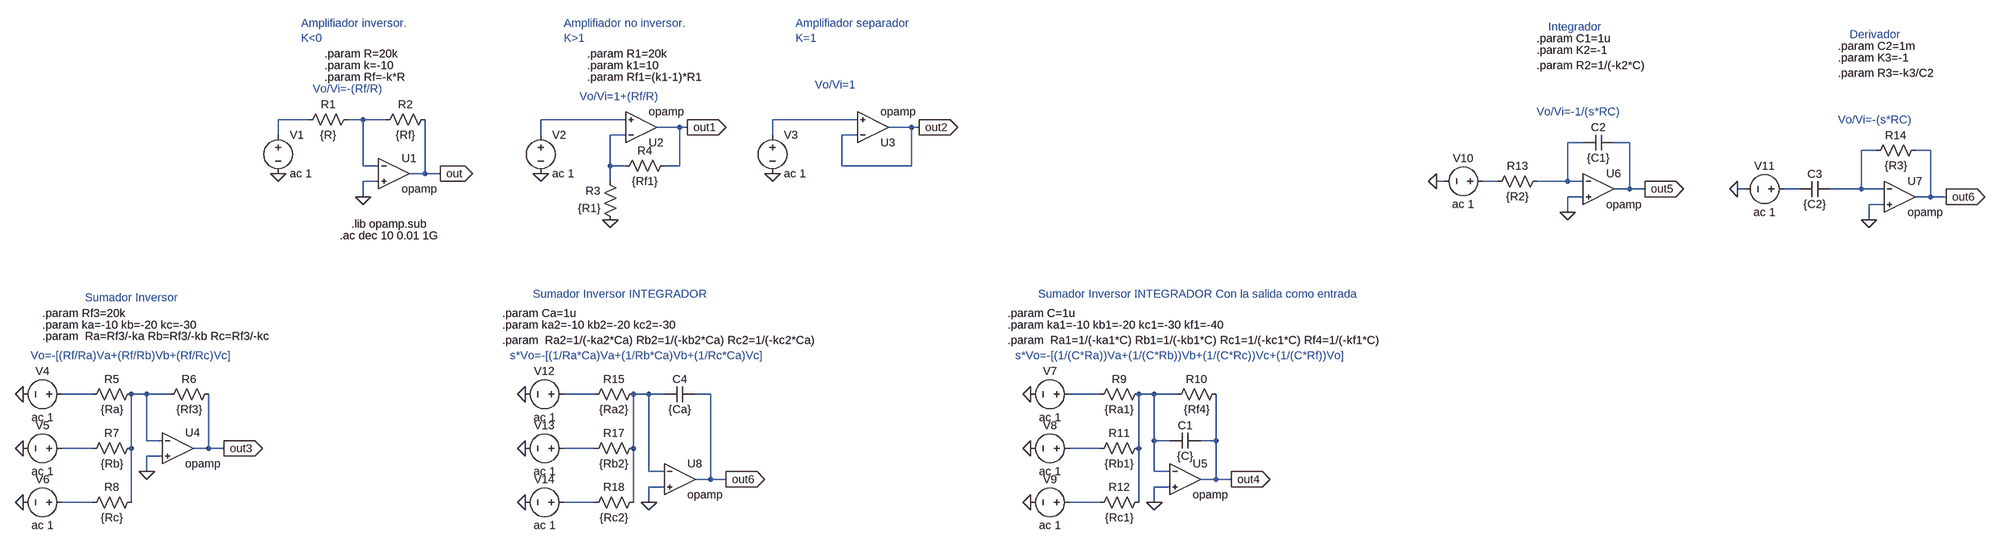
[diagram p0: schematic basicos.asc]
basicos.asc, the LTspice schematic file:
Version 4
SHEET 1 4512 1040
WIRE -96 128 -160 128
WIRE 16 128 -16 128
WIRE 64 128 16 128
WIRE 560 128 384 128
WIRE 1040 128 864 128
WIRE 672 144 624 144
WIRE 688 144 672 144
WIRE 1152 144 1104 144
WIRE 1168 144 1152 144
WIRE -160 160 -160 128
WIRE 384 160 384 128
WIRE 560 160 528 160
WIRE 864 160 864 128
WIRE 1040 160 1008 160
WIRE 3648 176 3616 176
WIRE 3744 176 3712 176
WIRE 4256 192 4224 192
WIRE 4368 192 4336 192
WIRE 16 224 16 128
WIRE 48 224 16 224
WIRE 528 224 528 160
WIRE 560 224 528 224
WIRE 672 224 672 144
WIRE 672 224 640 224
WIRE 1008 224 1008 160
WIRE 1152 224 1152 144
WIRE 1152 224 1008 224
WIRE 144 240 144 128
WIRE 144 240 112 240
WIRE 176 240 144 240
WIRE 48 256 16 256
WIRE 528 256 528 224
WIRE 3360 256 3344 256
WIRE 3472 256 3440 256
WIRE 3616 256 3616 176
WIRE 3616 256 3552 256
WIRE 3648 256 3616 256
WIRE 3744 272 3744 176
WIRE 3744 272 3712 272
WIRE 3776 272 3744 272
WIRE 3984 272 3968 272
WIRE 4096 272 4064 272
WIRE 4224 272 4224 192
WIRE 4224 272 4160 272
WIRE 4272 272 4224 272
WIRE 16 288 16 256
WIRE 3648 288 3616 288
WIRE 4368 288 4368 192
WIRE 4368 288 4336 288
WIRE 4400 288 4368 288
WIRE 4272 304 4240 304
WIRE 3616 320 3616 288
WIRE 4240 336 4240 304
WIRE -544 752 -608 752
WIRE -432 752 -464 752
WIRE -384 752 -432 752
WIRE 496 752 432 752
WIRE 608 752 576 752
WIRE 640 752 608 752
WIRE 736 752 704 752
WIRE 1616 752 1552 752
WIRE 1728 752 1696 752
WIRE 1776 752 1728 752
WIRE -432 848 -432 752
WIRE -400 848 -432 848
WIRE 1728 848 1728 752
WIRE 1760 848 1728 848
WIRE 1856 848 1856 752
WIRE 1856 848 1824 848
WIRE -544 864 -608 864
WIRE -464 864 -464 752
WIRE -304 864 -304 752
WIRE -304 864 -336 864
WIRE -272 864 -304 864
WIRE 496 864 432 864
WIRE 576 864 576 752
WIRE 1616 864 1552 864
WIRE 1696 864 1696 752
WIRE -400 880 -432 880
WIRE -432 912 -432 880
WIRE 608 912 608 752
WIRE 640 912 608 912
WIRE 1728 912 1728 848
WIRE 1760 912 1728 912
WIRE 736 928 736 752
WIRE 736 928 704 928
WIRE 768 928 736 928
WIRE 1856 928 1856 848
WIRE 1856 928 1824 928
WIRE 1888 928 1856 928
WIRE 640 944 608 944
WIRE 1760 944 1728 944
WIRE -544 976 -608 976
WIRE -464 976 -464 864
WIRE 496 976 432 976
WIRE 576 976 576 864
WIRE 608 976 608 944
WIRE 1616 976 1552 976
WIRE 1696 976 1696 864
WIRE 1728 976 1728 944
FLAG 16 288 0
FLAG -160 240 0
FLAG 176 240 out
IOPIN 176 240 Out
FLAG 384 240 0
FLAG 688 144 out1
IOPIN 688 144 Out
FLAG 528 336 0
FLAG 864 240 0
FLAG 1168 144 out2
IOPIN 1168 144 Out
FLAG -432 912 0
FLAG -688 752 0
FLAG -272 864 out3
IOPIN -272 864 Out
FLAG -688 864 0
FLAG -688 976 0
FLAG 1728 976 0
FLAG 1472 752 0
FLAG 1888 928 out4
IOPIN 1888 928 Out
FLAG 1472 864 0
FLAG 1472 976 0
FLAG 3616 320 0
FLAG 3776 272 out5
IOPIN 3776 272 Out
FLAG 3344 256 0
FLAG 4240 336 0
FLAG 4400 288 out6
IOPIN 4400 288 Out
FLAG 3968 272 0
FLAG 608 976 0
FLAG 352 752 0
FLAG 768 928 out6
IOPIN 768 928 Out
FLAG 352 864 0
FLAG 352 976 0
SYMBOL res 0 112 R90
WINDOW 0 0 56 VBottom 2
WINDOW 3 32 56 VTop 2
SYMATTR InstName R1
SYMATTR Value {R}
SYMBOL res 160 112 R90
WINDOW 0 0 56 VBottom 2
WINDOW 3 32 56 VTop 2
SYMATTR InstName R2
SYMATTR Value {Rf}
SYMBOL OpAmps\\opamp 80 176 R0
SYMATTR InstName U1
SYMBOL voltage -160 144 R0
SYMATTR InstName V1
SYMATTR Value ac 1
SYMBOL res 544 352 R180
WINDOW 0 36 76 Left 2
WINDOW 3 36 40 Left 2
SYMATTR InstName R3
SYMATTR Value {R1}
SYMBOL res 656 208 R90
WINDOW 0 0 56 VBottom 2
WINDOW 3 32 56 VTop 2
SYMATTR InstName R4
SYMATTR Value {Rf1}
SYMBOL OpAmps\\opamp 592 208 M180
SYMATTR InstName U2
SYMBOL voltage 384 144 R0
SYMATTR InstName V2
SYMATTR Value ac 1
SYMBOL OpAmps\\opamp 1072 208 M180
SYMATTR InstName U3
SYMBOL voltage 864 144 R0
SYMATTR InstName V3
SYMATTR Value ac 1
SYMBOL res -448 736 R90
WINDOW 0 0 56 VBottom 2
WINDOW 3 32 56 VTop 2
SYMATTR InstName R5
SYMATTR Value {Ra}
SYMBOL res -288 736 R90
WINDOW 0 0 56 VBottom 2
WINDOW 3 32 56 VTop 2
SYMATTR InstName R6
SYMATTR Value {Rf3}
SYMBOL OpAmps\\opamp -368 800 R0
SYMATTR InstName U4
SYMBOL res -448 848 R90
WINDOW 0 0 56 VBottom 2
WINDOW 3 32 56 VTop 2
SYMATTR InstName R7
SYMATTR Value {Rb}
SYMBOL res -448 960 R90
WINDOW 0 0 56 VBottom 2
WINDOW 3 32 56 VTop 2
SYMATTR InstName R8
SYMATTR Value {Rc}
SYMBOL voltage -592 752 R90
WINDOW 0 -32 56 VBottom 2
WINDOW 3 32 56 VTop 2
WINDOW 123 0 0 Left 0
WINDOW 39 0 0 Left 0
SYMATTR InstName V4
SYMATTR Value ac 1
SYMBOL voltage -592 864 R90
WINDOW 0 -32 56 VBottom 2
WINDOW 3 32 56 VTop 2
WINDOW 123 0 0 Left 0
WINDOW 39 0 0 Left 0
SYMATTR InstName V5
SYMATTR Value ac 1
SYMBOL voltage -592 976 R90
WINDOW 0 -32 56 VBottom 2
WINDOW 3 32 56 VTop 2
WINDOW 123 0 0 Left 0
WINDOW 39 0 0 Left 0
SYMATTR InstName V6
SYMATTR Value ac 1
SYMBOL res 1712 736 R90
WINDOW 0 0 56 VBottom 2
WINDOW 3 32 56 VTop 2
SYMATTR InstName R9
SYMATTR Value {Ra1}
SYMBOL res 1872 736 R90
WINDOW 0 0 56 VBottom 2
WINDOW 3 32 56 VTop 2
SYMATTR InstName R10
SYMATTR Value {Rf4}
SYMBOL OpAmps\\opamp 1792 864 R0
SYMATTR InstName U5
SYMBOL res 1712 848 R90
WINDOW 0 0 56 VBottom 2
WINDOW 3 32 56 VTop 2
SYMATTR InstName R11
SYMATTR Value {Rb1}
SYMBOL res 1712 960 R90
WINDOW 0 0 56 VBottom 2
WINDOW 3 32 56 VTop 2
SYMATTR InstName R12
SYMATTR Value {Rc1}
SYMBOL voltage 1568 752 R90
WINDOW 0 -32 56 VBottom 2
WINDOW 3 32 56 VTop 2
WINDOW 123 0 0 Left 0
WINDOW 39 0 0 Left 0
SYMATTR InstName V7
SYMATTR Value ac 1
SYMBOL voltage 1568 864 R90
WINDOW 0 -32 56 VBottom 2
WINDOW 3 32 56 VTop 2
WINDOW 123 0 0 Left 0
WINDOW 39 0 0 Left 0
SYMATTR InstName V8
SYMATTR Value ac 1
SYMBOL voltage 1568 976 R90
WINDOW 0 -32 56 VBottom 2
WINDOW 3 32 56 VTop 2
WINDOW 123 0 0 Left 0
WINDOW 39 0 0 Left 0
SYMATTR InstName V9
SYMATTR Value ac 1
SYMBOL cap 1824 832 R90
WINDOW 0 0 32 VBottom 2
WINDOW 3 32 32 VTop 2
SYMATTR InstName C1
SYMATTR Value {C}
SYMBOL OpAmps\\opamp 3680 208 R0
SYMATTR InstName U6
SYMBOL cap 3712 160 R90
WINDOW 0 0 32 VBottom 2
WINDOW 3 32 32 VTop 2
SYMATTR InstName C2
SYMATTR Value {C1}
SYMBOL res 3568 240 R90
WINDOW 0 0 56 VBottom 2
WINDOW 3 32 56 VTop 2
SYMATTR InstName R13
SYMATTR Value {R2}
SYMBOL voltage 3456 256 R90
WINDOW 0 -32 56 VBottom 2
WINDOW 3 32 56 VTop 2
WINDOW 123 0 0 Left 0
WINDOW 39 0 0 Left 0
SYMATTR InstName V10
SYMATTR Value ac 1
SYMBOL OpAmps\\opamp 4304 224 R0
SYMATTR InstName U7
SYMATTR SpiceLine2 GBW=100Meg
SYMBOL cap 4160 256 R90
WINDOW 0 0 32 VBottom 2
WINDOW 3 32 32 VTop 2
SYMATTR InstName C3
SYMATTR Value {C2}
SYMBOL res 4352 176 R90
WINDOW 0 0 56 VBottom 2
WINDOW 3 32 56 VTop 2
SYMATTR InstName R14
SYMATTR Value {R3}
SYMBOL voltage 4080 272 R90
WINDOW 0 -32 56 VBottom 2
WINDOW 3 32 56 VTop 2
WINDOW 123 0 0 Left 0
WINDOW 39 0 0 Left 0
SYMATTR InstName V11
SYMATTR Value ac 1
SYMBOL res 592 736 R90
WINDOW 0 0 56 VBottom 2
WINDOW 3 32 56 VTop 2
SYMATTR InstName R15
SYMATTR Value {Ra2}
SYMBOL OpAmps\\opamp 672 864 R0
SYMATTR InstName U8
SYMBOL res 592 848 R90
WINDOW 0 0 56 VBottom 2
WINDOW 3 32 56 VTop 2
SYMATTR InstName R17
SYMATTR Value {Rb2}
SYMBOL res 592 960 R90
WINDOW 0 0 56 VBottom 2
WINDOW 3 32 56 VTop 2
SYMATTR InstName R18
SYMATTR Value {Rc2}
SYMBOL voltage 448 752 R90
WINDOW 0 -32 56 VBottom 2
WINDOW 3 32 56 VTop 2
WINDOW 123 0 0 Left 0
WINDOW 39 0 0 Left 0
SYMATTR InstName V12
SYMATTR Value ac 1
SYMBOL voltage 448 864 R90
WINDOW 0 -32 56 VBottom 2
WINDOW 3 32 56 VTop 2
WINDOW 123 0 0 Left 0
WINDOW 39 0 0 Left 0
SYMATTR InstName V13
SYMATTR Value ac 1
SYMBOL voltage 448 976 R90
WINDOW 0 -32 56 VBottom 2
WINDOW 3 32 56 VTop 2
WINDOW 123 0 0 Left 0
WINDOW 39 0 0 Left 0
SYMATTR InstName V14
SYMATTR Value ac 1
SYMBOL cap 704 736 R90
WINDOW 0 0 32 VBottom 2
WINDOW 3 32 32 VTop 2
SYMATTR InstName C4
SYMATTR Value {Ca}
TEXT -8 344 Left 2 !.lib opamp.sub
TEXT -64 -8 Left 2 !.param R=20k
TEXT -64 16 Left 2 !.param k=-10
TEXT -64 40 Left 2 !.param Rf=-k*R
TEXT -112 -72 Left 2 ;Amplifiador inversor.\nK<0
TEXT -32 368 Left 2 !.ac dec 10 0.01 1G
TEXT 480 -8 Left 2 !.param R1=20k
TEXT 480 16 Left 2 !.param k1=10
TEXT 480 40 Left 2 !.param Rf1=(k1-1)*R1
TEXT 432 -72 Left 2 ;Amplifiador no inversor.\nK>1
TEXT 912 -72 Left 2 ;Amplifiador separador\nK=1
TEXT -648 584 Left 2 !.param Rf3=20k
TEXT -648 608 Left 2 !.param ka=-10 kb=-20 kc=-30
TEXT -648 632 Left 2 !.param  Ra=Rf3/-ka Rb=Rf3/-kb Rc=Rf3/-kc
TEXT -560 552 Left 2 ;Sumador Inversor
TEXT -88 64 Left 2 ;Vo/Vi=-(Rf/R)
TEXT 464 80 Left 2 ;Vo/Vi=1+(Rf/R)
TEXT 952 56 Left 2 ;Vo/Vi=1
TEXT -672 672 Left 2 ;Vo=-[(Rf/Ra)Va+(Rf/Rb)Vb+(Rf/Rc)Vc]
TEXT 1424 584 Left 2 !.param C=1u
TEXT 1424 608 Left 2 !.param ka1=-10 kb1=-20 kc1=-30 kf1=-40
TEXT 1424 640 Left 2 !.param  Ra1=1/(-ka1*C) Rb1=1/(-kb1*C) Rc1=1/(-kc1*C) Rf4=1/(-kf1*C)
TEXT 1488 544 Left 2 ;Sumador Inversor INTEGRADOR Con la salida como entrada
TEXT 1440 672 Left 2 ;s*Vo=-[(1/(C*Ra))Va+(1/(C*Rb))Vb+(1/(C*Rc))Vc+(1/(C*Rf))Vo]
TEXT 3576 -64 Left 2 ;Integrador
TEXT 3552 16 Left 2 !.param R2=1/(-k2*C)
TEXT 3552 112 Left 2 ;Vo/Vi=-1/(s*RC)
TEXT 3552 -40 Left 2 !.param C1=1u
TEXT 3552 -16 Left 2 !.param K2=-1
TEXT 4200 -48 Left 2 ;Derivador
TEXT 4176 32 Left 2 !.param R3=-k3/C2
TEXT 4176 128 Left 2 ;Vo/Vi=-(s*RC)
TEXT 4176 -24 Left 2 !.param C2=1m
TEXT 4176 0 Left 2 !.param K3=-1
TEXT 304 584 Left 2 !.param Ca=1u
TEXT 304 608 Left 2 !.param ka2=-10 kb2=-20 kc2=-30
TEXT 368 544 Left 2 ;Sumador Inversor INTEGRADOR
TEXT 304 640 Left 2 !.param  Ra2=1/(-ka2*Ca) Rb2=1/(-kb2*Ca) Rc2=1/(-kc2*Ca)
TEXT 320 672 Left 2 ;s*Vo=-[(1/Ra*Ca)Va+(1/Rb*Ca)Vb+(1/Rc*Ca)Vc]

The netlist it stands for:
* basicos.asc
R1 N002 N001 {R}
R2 out N002 {Rf}
XU1 N002 0 out opamp Aol=100K GBW=10Meg  ; pins invin noninvin out
V1 N001 0 ac 1
R3 0 N005 {R1}
R4 out1 N005 {Rf1}
XU2 N005 N003 out1 opamp Aol=100K GBW=10Meg  ; pins invin noninvin out
V2 N003 0 ac 1
XU3 out2 N004 out2 opamp Aol=100K GBW=10Meg  ; pins invin noninvin out
V3 N004 0 ac 1
R5 N011 N010 {Ra}
R6 out3 N011 {Rf3}
XU4 N011 0 out3 opamp Aol=100K GBW=10Meg  ; pins invin noninvin out
R7 N011 N016 {Rb}
R8 N011 N019 {Rc}
V4 N010 0 ac 1
V5 N016 0 ac 1
V6 N019 0 ac 1
R9 N015 N014 {Ra1}
R10 out4 N015 {Rf4}
XU5 N015 0 out4 opamp Aol=100K GBW=10Meg  ; pins invin noninvin out
R11 N015 N018 {Rb1}
R12 N015 N021 {Rc1}
V7 N014 0 ac 1
V8 N018 0 ac 1
V9 N021 0 ac 1
C1 out4 N015 {C}
XU6 N006 0 out5 opamp Aol=100K GBW=10Meg  ; pins invin noninvin out
C2 out5 N006 {C1}
R13 N006 N008 {R2}
V10 N008 0 ac 1
XU7 N007 0 out6 opamp Aol=100K GBW=100Meg  ; pins invin noninvin out
C3 N007 N009 {C2}
R14 out6 N007 {R3}
V11 N009 0 ac 1
R15 N013 N012 {Ra2}
XU8 N013 0 out6 opamp Aol=100K GBW=10Meg  ; pins invin noninvin out
R17 N013 N017 {Rb2}
R18 N013 N020 {Rc2}
V12 N012 0 ac 1
V13 N017 0 ac 1
V14 N020 0 ac 1
C4 out6 N013 {Ca}
.lib opamp.sub
.param R=20k
.param k=-10
.param Rf=-k*R
* Amplifiador inversor.
* K<0
.ac dec 10 0.01 1G
.param R1=20k
.param k1=10
.param Rf1=(k1-1)*R1
* Amplifiador no inversor.
* K>1
* Amplifiador separador
* K=1
.param Rf3=20k
.param ka=-10 kb=-20 kc=-30
.param  Ra=Rf3/-ka Rb=Rf3/-kb Rc=Rf3/-kc
* Sumador Inversor
* Vo/Vi=-(Rf/R)
* Vo/Vi=1+(Rf/R)
* Vo/Vi=1
* Vo=-[(Rf/Ra)Va+(Rf/Rb)Vb+(Rf/Rc)Vc]
.param C=1u
.param ka1=-10 kb1=-20 kc1=-30 kf1=-40
.param  Ra1=1/(-ka1*C) Rb1=1/(-kb1*C) Rc1=1/(-kc1*C) Rf4=1/(-kf1*C)
* Sumador Inversor INTEGRADOR Con la salida como entrada
* s*Vo=-[(1/(C*Ra))Va+(1/(C*Rb))Vb+(1/(C*Rc))Vc+(1/(C*Rf))Vo]
* Integrador
.param R2=1/(-k2*C)
* Vo/Vi=-1/(s*RC)
.param C1=1u
.param K2=-1
* Derivador
.param R3=-k3/C2
* Vo/Vi=-(s*RC)
.param C2=1m
.param K3=-1
.param Ca=1u
.param ka2=-10 kb2=-20 kc2=-30
* Sumador Inversor INTEGRADOR
.param  Ra2=1/(-ka2*Ca) Rb2=1/(-kb2*Ca) Rc2=1/(-kc2*Ca)
* s*Vo=-[(1/Ra*Ca)Va+(1/Rb*Ca)Vb+(1/Rc*Ca)Vc]
.backanno
.end